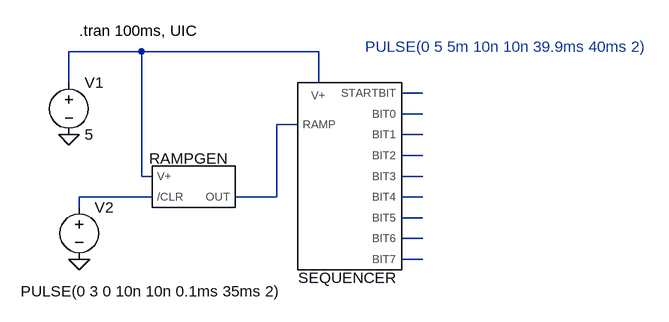
[diagram p0: schematic _RampGen.asc]
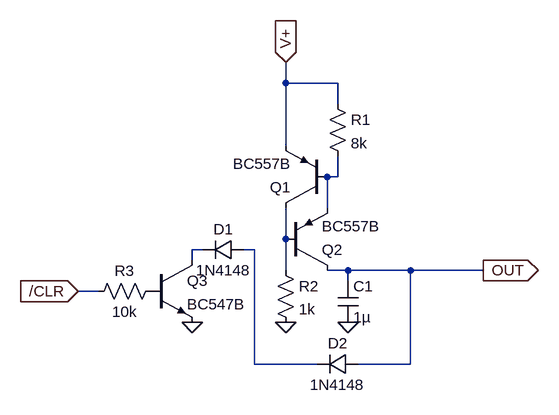
[diagram p1: sub-circuit rampgen.asc]
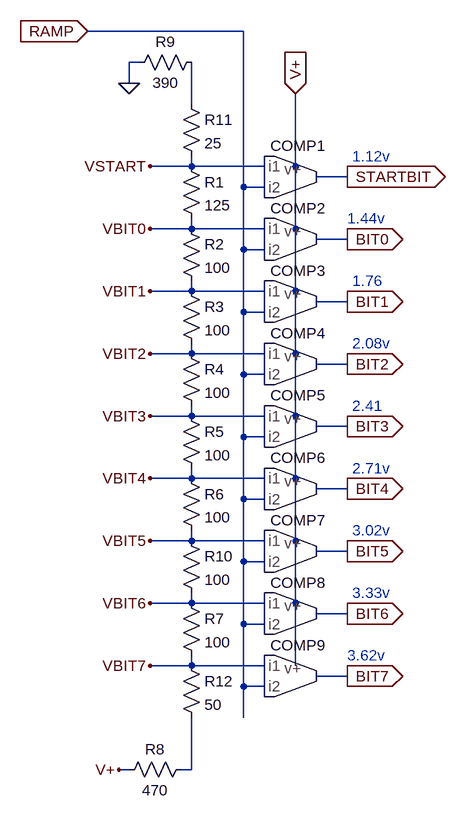
[diagram p2: sub-circuit uart-rx-sequencer.asc]
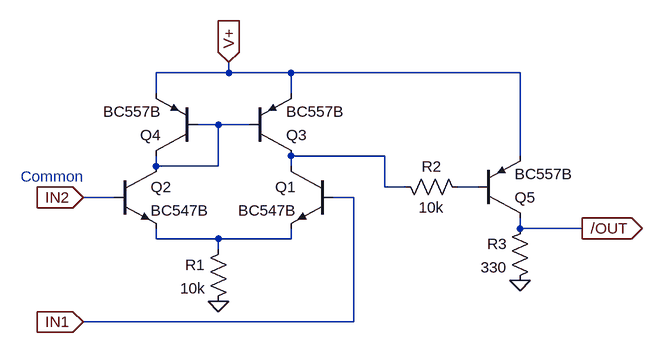
[diagram p3: sub-circuit comparator.asc]
_RampGen.asc, the LTspice schematic file:
Version 4
SHEET 1 1140 1184
WIRE 352 -144 240 -144
WIRE 624 -144 352 -144
WIRE 240 -96 240 -144
WIRE 624 -96 624 -144
WIRE 784 -80 752 -80
WIRE 784 -48 752 -48
WIRE 592 -32 560 -32
WIRE 784 -16 752 -16
WIRE 784 16 752 16
WIRE 352 48 352 -144
WIRE 368 48 352 48
WIRE 784 48 752 48
WIRE 368 80 256 80
WIRE 560 80 560 -32
WIRE 560 80 496 80
WIRE 784 80 752 80
WIRE 256 96 256 80
WIRE 784 112 752 112
WIRE 784 144 752 144
WIRE 784 176 752 176
FLAG 240 -16 0
FLAG 256 176 0
SYMBOL voltage 240 -112 R0
SYMATTR InstName V1
SYMATTR Value 5
SYMBOL voltage 256 80 R0
WINDOW 3 312 145 Right 2
SYMATTR Value PULSE(0 3 0 10n 10n 0.1ms 35ms 2)
SYMATTR InstName V2
SYMBOL RampGen 416 80 R0
SYMATTR InstName RAMPGEN
SYMBOL UART-Rx-Sequencer 640 32 R0
SYMATTR InstName SEQUENCER
TEXT 256 -176 Left 2 !.tran 100ms, UIC
TEXT 696 -152 Left 2 ;PULSE(0 5 5m 10n 10n 39.9ms 40ms 2)

rampgen.asc, the sub-circuit schematic file:
Version 4
SHEET 1 1276 1184
WIRE 832 -64 832 -96
WIRE 912 -64 832 -64
WIRE 912 -32 912 -64
WIRE 832 32 832 -64
WIRE 912 80 912 48
WIRE 912 80 896 80
WIRE 896 128 896 80
WIRE 832 176 832 128
WIRE 704 192 688 192
WIRE 784 192 768 192
WIRE 688 208 688 192
WIRE 832 224 832 176
WIRE 928 224 896 224
WIRE 1024 224 928 224
WIRE 1136 224 1024 224
WIRE 928 240 928 224
WIRE 544 256 512 256
WIRE 784 368 784 192
WIRE 880 368 784 368
WIRE 1024 368 1024 224
WIRE 1024 368 944 368
FLAG 688 304 0
FLAG 512 256 /CLR
IOPIN 512 256 In
FLAG 832 304 0
FLAG 832 -96 V+
IOPIN 832 -96 In
FLAG 928 304 0
FLAG 1136 224 OUT
IOPIN 1136 224 Out
SYMBOL npn 624 208 R0
SYMATTR InstName Q3
SYMATTR Value BC547B
SYMBOL res 640 240 R90
WINDOW 0 0 56 VBottom 2
WINDOW 3 32 56 VTop 2
SYMATTR InstName R3
SYMATTR Value 10k
SYMBOL pnp 832 224 M180
SYMATTR InstName Q2
SYMATTR Value BC557B
SYMBOL pnp 896 128 R180
SYMATTR InstName Q1
SYMATTR Value BC557B
SYMBOL res 816 208 R0
SYMATTR InstName R2
SYMATTR Value 1k
SYMBOL cap 912 240 R0
SYMATTR InstName C1
SYMATTR Value 1µ
SYMBOL res 896 -48 R0
SYMATTR InstName R1
SYMATTR Value 8k
SYMBOL diode 768 176 R90
WINDOW 0 0 32 VBottom 2
WINDOW 3 32 32 VTop 2
SYMATTR InstName D1
SYMATTR Value 1N4148
SYMBOL diode 944 352 R90
WINDOW 0 0 32 VBottom 2
WINDOW 3 32 32 VTop 2
SYMATTR InstName D2
SYMATTR Value 1N4148

uart-rx-sequencer.asc, the sub-circuit schematic file:
Version 4
SHEET 1 880 1152
WIRE 128 -192 -112 -192
WIRE -32 -144 -48 -144
WIRE -48 -112 -48 -144
WIRE 48 -80 48 -144
WIRE 48 16 48 0
WIRE 48 16 -16 16
WIRE 160 16 48 16
WIRE 208 16 208 -96
WIRE 288 32 240 32
WIRE 128 48 128 -192
WIRE 160 48 128 48
WIRE 48 112 48 96
WIRE 48 112 -16 112
WIRE 160 112 48 112
WIRE 208 112 208 16
WIRE 288 128 240 128
WIRE 128 144 128 48
WIRE 160 144 128 144
WIRE 48 208 48 192
WIRE 48 208 -16 208
WIRE 160 208 48 208
WIRE 208 208 208 112
WIRE 288 224 240 224
WIRE 128 240 128 144
WIRE 160 240 128 240
WIRE 48 304 48 288
WIRE 48 304 -16 304
WIRE 160 304 48 304
WIRE 208 304 208 208
WIRE 288 320 240 320
WIRE 128 336 128 240
WIRE 160 336 128 336
WIRE 48 400 48 384
WIRE 48 400 -16 400
WIRE 160 400 48 400
WIRE 208 400 208 304
WIRE 288 416 240 416
WIRE 128 432 128 336
WIRE 160 432 128 432
WIRE 48 496 48 480
WIRE 48 496 -16 496
WIRE 160 496 48 496
WIRE 208 496 208 400
WIRE 288 512 240 512
WIRE 128 528 128 432
WIRE 160 528 128 528
WIRE 48 592 48 576
WIRE 48 592 -16 592
WIRE 160 592 48 592
WIRE 208 592 208 496
WIRE 288 608 240 608
WIRE 128 624 128 528
WIRE 160 624 128 624
WIRE 48 688 48 672
WIRE 48 688 -16 688
WIRE 160 688 48 688
WIRE 208 688 208 592
WIRE 288 704 240 704
WIRE 128 720 128 624
WIRE 160 720 128 720
WIRE 48 784 48 768
WIRE 48 784 -16 784
WIRE 160 784 48 784
WIRE 208 784 208 688
WIRE 288 800 240 800
WIRE 128 816 128 720
WIRE 160 816 128 816
WIRE 128 864 128 816
WIRE -48 944 -64 944
WIRE 48 944 48 864
WIRE 48 944 32 944
FLAG 288 32 STARTBIT
IOPIN 288 32 Out
FLAG 288 128 BIT0
IOPIN 288 128 Out
FLAG 288 224 BIT1
IOPIN 288 224 Out
FLAG 288 320 BIT2
IOPIN 288 320 Out
FLAG 288 416 BIT3
IOPIN 288 416 Out
FLAG 288 512 BIT4
IOPIN 288 512 Out
FLAG 288 608 BIT5
IOPIN 288 608 Out
FLAG 288 704 BIT6
IOPIN 288 704 Out
FLAG 288 800 BIT7
IOPIN 288 800 Out
FLAG 208 -96 V+
IOPIN 208 -96 In
FLAG -112 -192 RAMP
IOPIN -112 -192 In
FLAG -48 -112 0
FLAG -64 944 V+
FLAG -16 16 VSTART
FLAG -16 112 VBIT0
FLAG -16 208 VBIT1
FLAG -16 304 VBIT2
FLAG -16 400 VBIT3
FLAG -16 496 VBIT4
FLAG -16 592 VBIT5
FLAG -16 688 VBIT6
FLAG -16 784 VBIT7
SYMBOL res 32 0 R0
SYMATTR InstName R1
SYMATTR Value 125
SYMBOL res 32 96 R0
SYMATTR InstName R2
SYMATTR Value 100
SYMBOL res 32 192 R0
SYMATTR InstName R3
SYMATTR Value 100
SYMBOL res 32 288 R0
SYMATTR InstName R4
SYMATTR Value 100
SYMBOL res 32 384 R0
SYMATTR InstName R5
SYMATTR Value 100
SYMBOL res 32 480 R0
SYMATTR InstName R6
SYMATTR Value 100
SYMBOL res 32 672 R0
SYMATTR InstName R7
SYMATTR Value 100
SYMBOL res 48 928 R90
WINDOW 0 0 56 VBottom 2
WINDOW 3 32 56 VTop 2
SYMATTR InstName R8
SYMATTR Value 470
SYMBOL res -48 -128 R270
WINDOW 0 32 56 VTop 2
WINDOW 3 0 56 VBottom 2
SYMATTR InstName R9
SYMATTR Value 390
SYMBOL res 32 576 R0
SYMATTR InstName R10
SYMATTR Value 100
SYMBOL Comparator 240 32 R0
SYMATTR InstName COMP1
SYMBOL Comparator 240 128 R0
SYMATTR InstName COMP2
SYMBOL Comparator 240 224 R0
SYMATTR InstName COMP3
SYMBOL Comparator 240 320 R0
SYMATTR InstName COMP4
SYMBOL Comparator 240 416 R0
SYMATTR InstName COMP5
SYMBOL Comparator 240 512 R0
SYMATTR InstName COMP6
SYMBOL Comparator 240 608 R0
SYMATTR InstName COMP7
SYMBOL Comparator 240 704 R0
SYMATTR InstName COMP8
SYMBOL Comparator 240 800 R0
SYMATTR InstName COMP9
SYMBOL res 32 -96 R0
SYMATTR InstName R11
SYMATTR Value 25
SYMBOL res 32 768 R0
SYMATTR InstName R12
SYMATTR Value 50
TEXT 296 0 Left 2 ;1.12v
TEXT 288 96 Left 2 ;1.44v
TEXT 296 192 Left 2 ;1.76
TEXT 296 288 Left 2 ;2.08v
TEXT 296 384 Left 2 ;2.41
TEXT 296 480 Left 2 ;2.71v
TEXT 296 576 Left 2 ;3.02v
TEXT 296 672 Left 2 ;3.33v
TEXT 288 768 Left 2 ;3.62v

comparator.asc, the sub-circuit schematic file:
Version 4
SHEET 1 1272 680
WIRE -32 -16 -32 -32
WIRE -32 -16 -144 -16
WIRE 64 -16 -32 -16
WIRE 416 -16 64 -16
WIRE -144 16 -144 -16
WIRE 64 16 64 -16
WIRE -48 64 -80 64
WIRE 0 64 -48 64
WIRE 208 112 64 112
WIRE 416 112 416 -16
WIRE -144 128 -144 112
WIRE -48 128 -48 64
WIRE -48 128 -144 128
WIRE 64 128 64 112
WIRE 208 160 208 112
WIRE 240 160 208 160
WIRE 352 160 320 160
WIRE -208 176 -256 176
WIRE 160 176 128 176
WIRE 416 224 416 208
WIRE 512 224 416 224
WIRE -144 240 -144 224
WIRE -48 240 -144 240
WIRE 64 240 64 224
WIRE 64 240 -48 240
WIRE -48 256 -48 240
WIRE 160 368 160 176
WIRE 160 368 -256 368
FLAG -48 336 0
FLAG 416 304 0
FLAG 512 224 /OUT
IOPIN 512 224 Out
FLAG -32 -32 V+
IOPIN -32 -32 In
FLAG -256 176 IN2
IOPIN -256 176 In
FLAG -256 368 IN1
IOPIN -256 368 In
SYMBOL npn 128 128 M0
SYMATTR InstName Q1
SYMATTR Value BC547B
SYMBOL pnp -80 112 R180
SYMATTR InstName Q4
SYMATTR Value BC557B
SYMBOL res -32 240 M0
SYMATTR InstName R1
SYMATTR Value 10k
SYMBOL npn -208 128 R0
SYMATTR InstName Q2
SYMATTR Value BC547B
SYMBOL res 432 208 M0
SYMATTR InstName R3
SYMATTR Value 330
SYMBOL res 224 144 M90
WINDOW 0 0 56 VBottom 2
WINDOW 3 32 56 VTop 2
SYMATTR InstName R2
SYMATTR Value 10k
SYMBOL pnp 0 112 M180
SYMATTR InstName Q3
SYMATTR Value BC557B
SYMBOL pnp 352 208 M180
SYMATTR InstName Q5
SYMATTR Value BC557B
TEXT -352 144 Left 2 ;Common

The netlist it stands for:
* _RampGen.asc
V1 N001 0 5
V2 N008 0 PULSE(0 3 0 10n 10n 0.1ms 35ms 2)
XRAMPGEN N008 N001 N004 rampgen
XSEQUENCER N002 N003 N005 N006 N007 N009 N010 N011 N001 N004 N012 uart-rx-sequencer

* block symbol definitions
.subckt rampgen /CLR V+ OUT
Q3 N003 P001 0 0 BC547B
R3 P001 /CLR 10k
Q2 OUT N002 N001 0 BC557B
Q1 N002 N001 V+ 0 BC557B
R2 N002 0 1k
C1 OUT 0 1µ
R1 V+ N001 8k
D1 N004 N003 1N4148
D2 OUT N004 1N4148
.ends rampgen

.subckt uart-rx-sequencer STARTBIT BIT0 BIT1 BIT2 BIT3 BIT4 BIT5 BIT6 V+ RAMP BIT7
R1 VSTART VBIT0 125
R2 VBIT0 VBIT1 100
R3 VBIT1 VBIT2 100
R4 VBIT2 VBIT3 100
R5 VBIT3 VBIT4 100
R6 VBIT4 VBIT5 100
R7 VBIT6 VBIT7 100
R8 N002 V+ 470
R9 0 N001 390
R10 VBIT5 VBIT6 100
XCOMP1 VSTART RAMP V+ STARTBIT comparator
XCOMP2 VBIT0 RAMP V+ BIT0 comparator
XCOMP3 VBIT1 RAMP V+ BIT1 comparator
XCOMP4 VBIT2 RAMP V+ BIT2 comparator
XCOMP5 VBIT3 RAMP V+ BIT3 comparator
XCOMP6 VBIT4 RAMP V+ BIT4 comparator
XCOMP7 VBIT5 RAMP V+ BIT5 comparator
XCOMP8 VBIT6 RAMP V+ BIT6 comparator
XCOMP9 VBIT7 RAMP V+ BIT7 comparator
R11 N001 VSTART 25
R12 VBIT7 N002 50
* 1.12v
* 1.44v
* 1.76
* 2.08v
* 2.41
* 2.71v
* 3.02v
* 3.33v
* 3.62v
.ends uart-rx-sequencer

.subckt comparator IN1 IN2 V+ /OUT
Q1 N002 IN1 N004 0 BC547B
Q4 N001 N001 V+ 0 BC557B
R1 N004 0 10k
Q2 N001 IN2 N004 0 BC547B
R3 /OUT 0 330
R2 N002 N003 10k
Q3 N002 N001 V+ 0 BC557B
Q5 /OUT N003 V+ 0 BC557B
* Common
.ends comparator

.model D D
.lib standard.dio
.model NPN NPN
.model PNP PNP
.lib standard.bjt
.tran 100ms, UIC
* PULSE(0 5 5m 10n 10n 39.9ms 40ms 2)
.backanno
.end